# Altium schematic sheet sch_lm3409.SchDoc
size A2
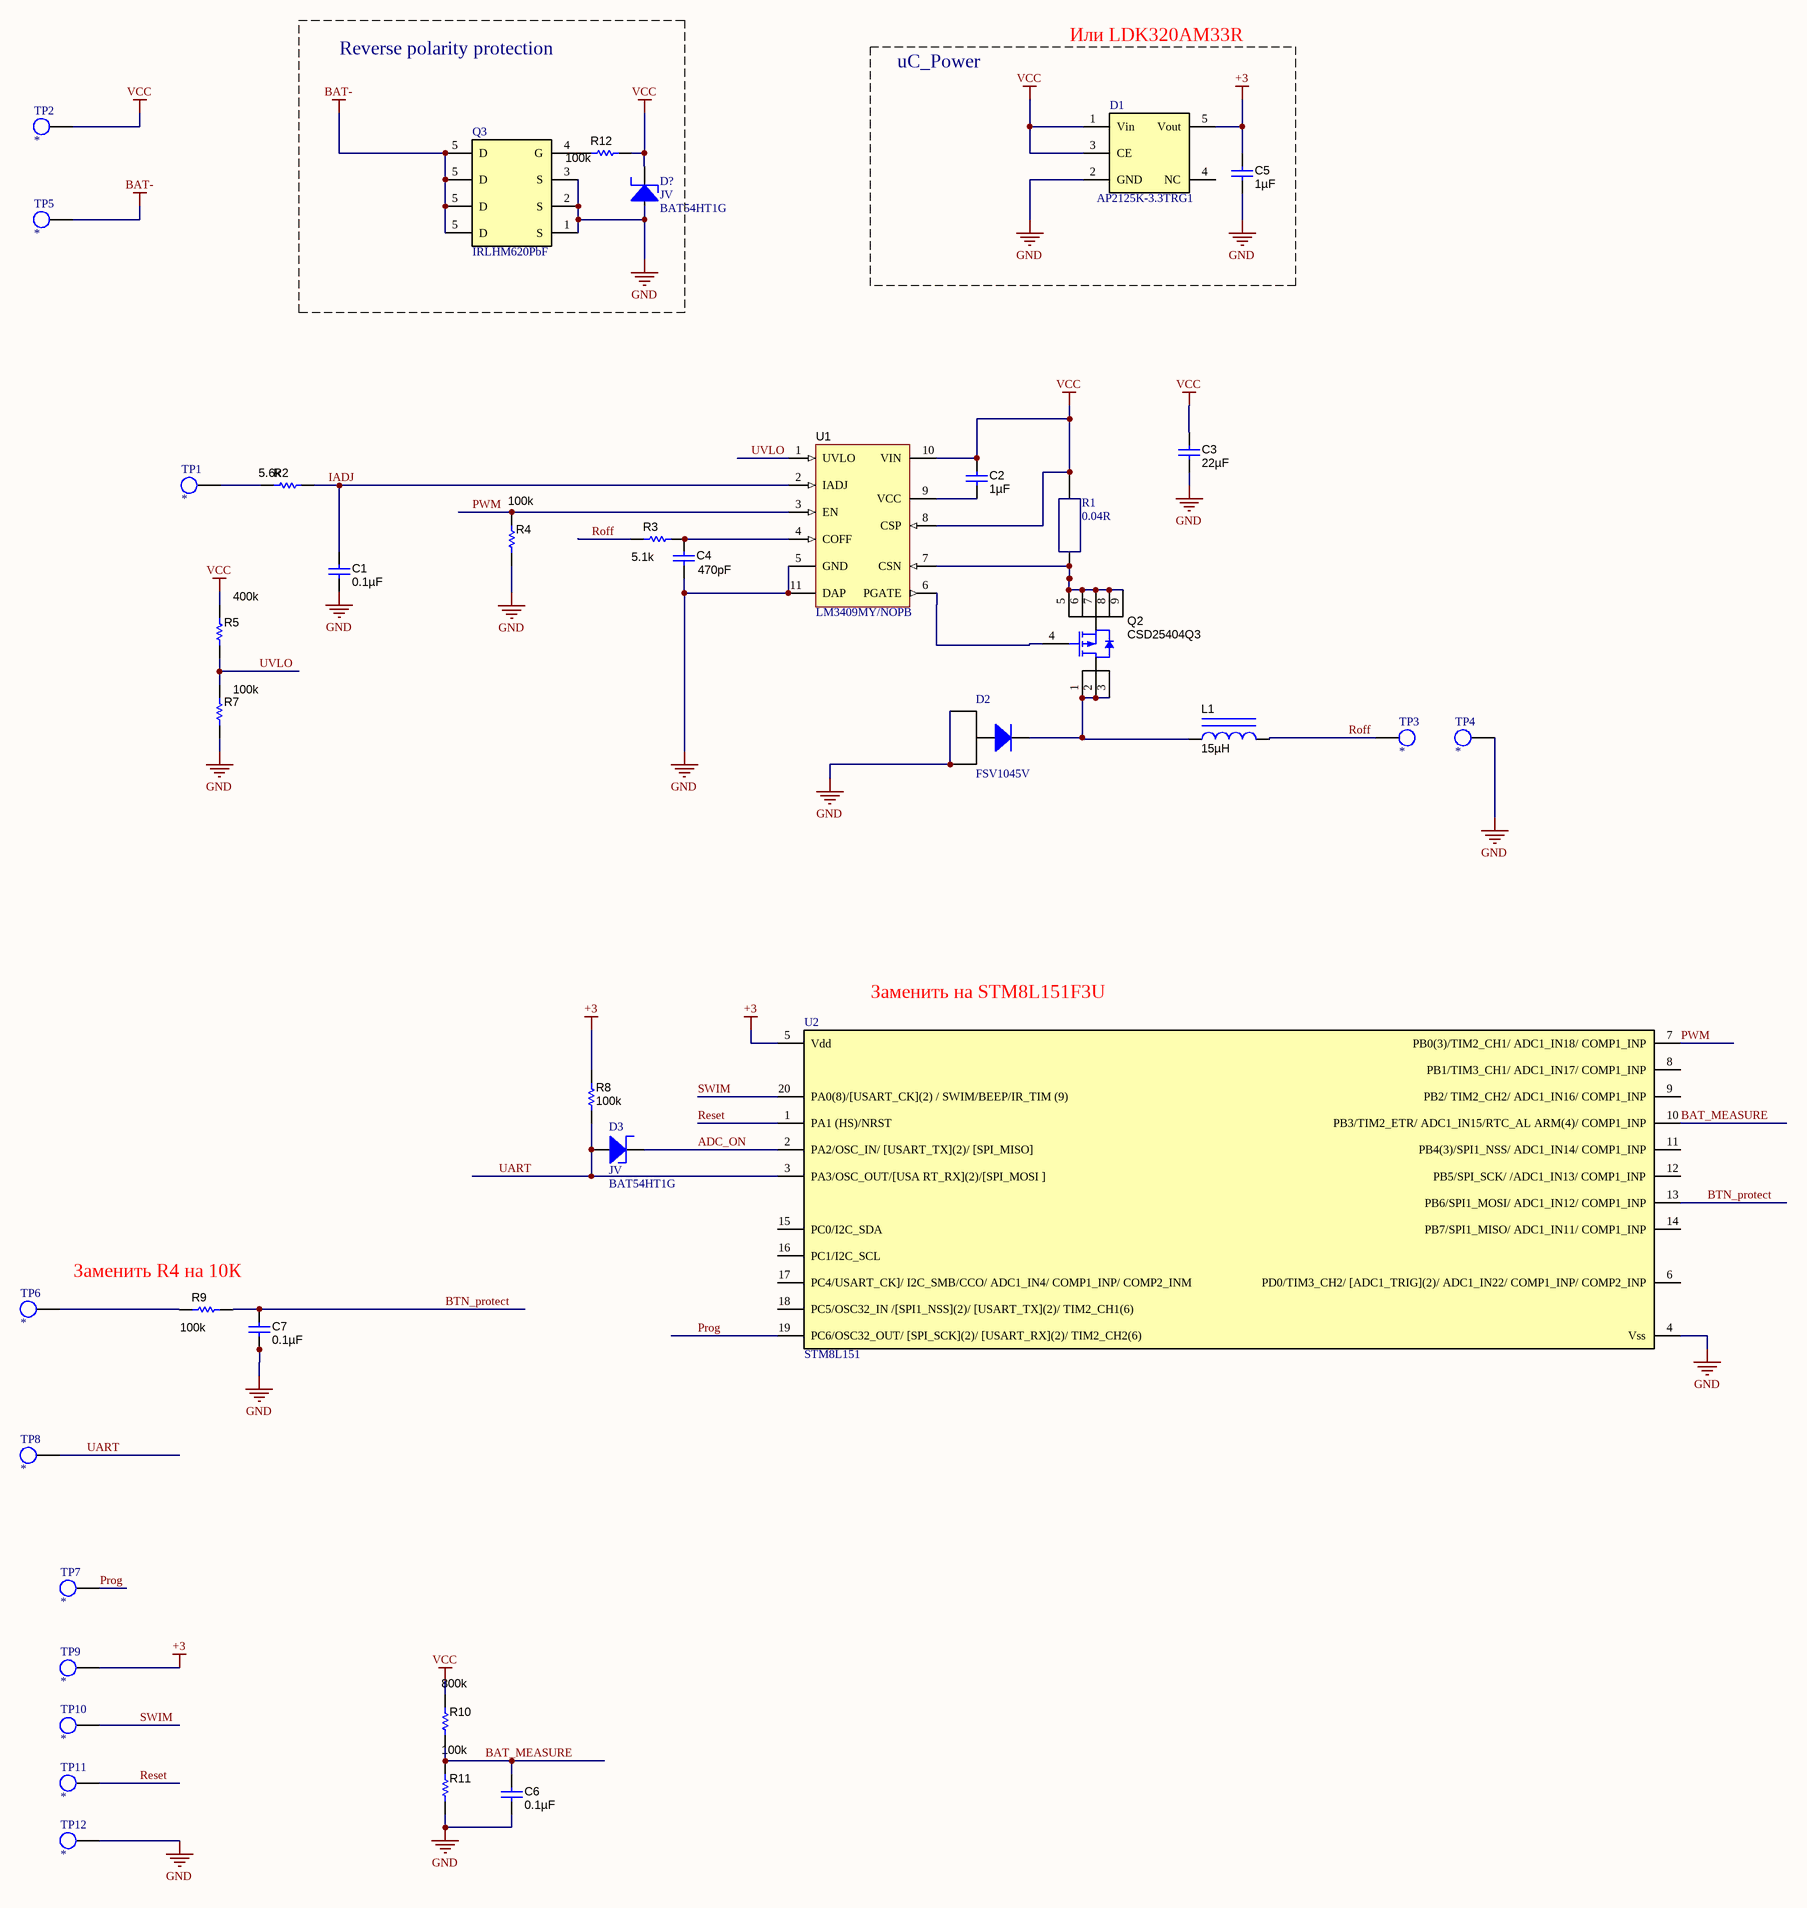
[diagram p0: sch_lm3409.SchDoc]

## Parts
C1  ValueDisplayed: 0.1µF  [0402]  (hidden comment: C1005X7R1E104M050BB)
C2  ValueDisplayed: 1µF  [0603]  (hidden comment: C1608X7R1C105K080AC)
C3  ValueDisplayed: 22µF  [0805_HV]  (hidden comment: C2012X7R1H105K125AB)
C4  value 470pF  [0402]  (hidden comment: C1005X7R1E104M050BB)
C5  ValueDisplayed: 1µF  [0603]  (hidden comment: C1608X7R1C105K080AC)
C6  ValueDisplayed: 0.1µF  [0402]  (hidden comment: C1005X7R1E104M050BB)
C7  ValueDisplayed: 0.1µF  [0402]  (hidden comment: C1005X7R1E104M050BB)
D1  AP2125K-3.3TRG1  [SOT23-5]
D2  FSV1045V  [TO-277]
D3  JV  value BAT54HT1G  [SOD323]
D?  JV  value BAT54HT1G  [SOD323]
L1  ValueDisplayed: 15µH  [WE-TPC-LH]  (hidden comment: 744053150)
Q2  CSD25404Q3  [DQG0008A]
Q3  value IRLHM620PbF  [PQFN-8 3.3x3.3]  (hidden comment: IRLHM620)
R1  value 0.04R  [Resistor 1206]  (hidden comment: PAD)
R2  value 5.6k  [0402]  (hidden comment: CRCW0402470RJNED)
R3  value 5.1k  [0402]  (hidden comment: CRCW0402470RJNED)
R4  value 100k  [0402]  (hidden comment: CRCW0402470RJNED)
R5  value 400k  [0402]  (hidden comment: CRCW0402470RJNED)
R7  value 100k  [0402]  (hidden comment: CRCW0402470RJNED)
R8  ValueDisplayed: 100k  [0402]  (hidden comment: CRCW0402470RJNED)
R9  value 100k  [0402]  (hidden comment: CRCW0402470RJNED)
R10  value 800k  [0402]  (hidden comment: CRCW0402470RJNED)
R11  value 100k  [0402]  (hidden comment: CRCW0402470RJNED)
R12  value 100k  [0402]  (hidden comment: CRCW0402470RJNED)
TP1  *  [TP 0.8mm]  (no BOM)
TP2  *  [TP 0.8mm]  (no BOM)
TP3  *  [TP 0.8mm]  (no BOM)
TP4  *  [TP 0.8mm]  (no BOM)
TP5  *  [TP 0.8mm]  (no BOM)
TP6  *  [TP 0.8mm]  (no BOM)
TP7  *  [TP 0.8mm]  (no BOM)
TP8  *  [TP 0.8mm]  (no BOM)
TP9  *  [TP 0.8mm]  (no BOM)
TP10  *  [TP 0.8mm]  (no BOM)
TP11  *  [TP 0.8mm]  (no BOM)
TP12  *  [TP 0.8mm]  (no BOM)
U1  LM3409MY/NOPB  [MUC10A_N]
U2  STM8L151  [UFQFPN20 3x3x0.5]

## Nets
+3: C5.1 D1.5(Vout) R8.2 TP9.1 U2.5(Vdd)
BAT-: Q3.5(D) TP5.1
GND: C1.2 C3.2 C4.2 C5.2 C6.2 C7.2 D1.2(GND) D2.1 D2.2 D?.2 Q3.1(S) Q3.2(S) Q3.3(S) R4.1 R7.1 R11.1 TP4.1 TP12.1 U1.5(GND) U1.11(DAP) U2.4(Vss)
VCC: C2.1 C3.1 D1.1(Vin) D1.3(CE) D?.1 R1.2 R5.2 R10.2 R12.1 TP2.1 U1.8(CSP) U1.10(VIN)
ADC_ON: D3.1 U2.2(PA2/OSC_IN/_[USART_TX](2)/_[SPI_MISO])
BAT_MEASURE: C6.1 R10.1 R11.2 U2.10(PB3/TIM2_ETR/_ADC1_IN15/RTC_AL_ARM(4)/_COMP1_INP)
BTN_protect: C7.1 R9.1 U2.13(PB6/SPI1_MOSI/_ADC1_IN12/_COMP1_INP)
IADJ: C1.1 R2.2 U1.2(IADJ)
Prog: TP7.1 U2.19(PC6/OSC32_OUT/_[SPI_SCK](2)/_[USART_RX](2)/_TIM2_CH2(6))
PWM: R4.2 U1.3(EN) U2.7(PB0(3)/TIM2_CH1/_ADC1_IN18/_COMP1_INP)
Reset: TP11.1 U2.1(PA1_(HS)/NRST)
Roff: L1.2 R3.1 TP3.1
SWIM: TP10.1 U2.20(PA0(8)/[USART_CK](2)_/_SWIM/BEEP/IR_TIM_(9))
UART: D3.2 R8.1 TP8.1 U2.3(PA3/OSC_OUT/[USA_RT_RX](2)/[SPI_MOSI_])
UVLO: R5.1 R7.2 U1.1(UVLO)
NetC2_2: C2.2 U1.9(VCC)
NetC4_1: C4.1 R3.2 U1.4(COFF)
NetD2_3: D2.3 L1.1 Q2.1(D) Q2.2(D) Q2.3(D)
NetQ2_4: Q2.4(G) U1.6(PGATE)
NetQ2_5: Q2.5(S) Q2.6(S) Q2.7(S) Q2.8(S) Q2.9(S) R1.1 U1.7(CSN)
NetQ3_4: Q3.4(G) R12.2
NetR2_1: R2.1 TP1.1
NetR9_2: R9.2 TP6.1

Not connected (* = marked no-connect by the designer): D1 4(NC); U2 6(PD0/TIM3_CH2/_[ADC1_TRIG](2)/_ADC1_IN22/_COMP1_INP/_COMP2_INP) 8(PB1/TIM3_CH1/_ADC1_IN17/_COMP1_INP) 9(PB2/_TIM2_CH2/_ADC1_IN16/_COMP1_INP) 11(PB4(3)/SPI1_NSS/_ADC1_IN14/_COMP1_INP) 12(PB5/SPI_SCK/_/ADC1_IN13/_COMP1_INP) 14(PB7/SPI1_MISO/_ADC1_IN11/_COMP1_INP) 15(PC0/I2C_SDA) 16(PC1/I2C_SCL) 17(PC4/USART_CK]/_I2C_SMB/CCO/_ADC1_IN4/_COMP1_INP/_COMP2_INM) 18(PC5/OSC32_IN_/[SPI1_NSS](2)/_[USART_TX](2)/_TIM2_CH1(6))

## Notes on the sheet
- Reverse polarity protection
- uC_Power
- Или LDK320AM33R
- (near U2) Заменить на STM8L151F3U
- Заменить R4 на 10К

## Library data of the parts
C1 C6 C7 = C1005X7R1E104M050BB: CAP, CERM, 0.1 µF, 25 V, +/- 20%, X7R, 0402; Manufacturer: TDK; Polarized: N; CompType: Capacitor; Value: 0.1uF; U/M: EA; Cap_F: 0.0000001; Tolerance_%: 20; Value1: Unknown; VDC_V: 25; Value2: 25V; TaMin_C: -55; TaMax_C: 125; SizeArea_mm2: 0.5; SizeAreaWB_mm2: 3; SizeX_mm: 1; SizeZ_mm: 0.6; AEC Category: Q200; SymbolVersion: 2008-07-09; PartNumber: C1005X7R1E104M050BB; PackageReference: 0402; RoHS: Y; MountType: SMT; Technology: Ceramic; TempCo: X7R; Cap_Case: 0402; SizeY_mm: 0.5; Published: 2008-06-19; Publisher: Texas Instruments; LatestRevisionDate: 2017-02-09; ComponentLink1Description: Datasheet link; ComponentLink1URL: http://product.tdk.com/en/catalog/datasheets/mlcc_commercial_general_en.pdf; Supplier 1: Digi-Key; Supplier Part Number 1: 445-7349-1-ND; Supplier 2: Mouser; Supplier Part Number 2: 810-C1005X7R1E104M; Supplier 3: Farnell; Supplier Part Number 3: 2354087; AEC Qualified: N; AEC Grade: N/A
C2 C5 = C1608X7R1C105K080AC: CAP, CERM, 1 µF, 16 V, +/- 10%, X7R, 0603; Manufacturer: TDK; Polarized: N; CompType: Capacitor; Value: 1uF; U/M: EA; Cap_F: 0.000001; Tolerance_%: 10; ESR_ohm: 0.0057; Value1: 0.0057 ohm; VDC_V: 16; Value2: 16V; TaMin_C: -55; TaMax_C: 125; SizeArea_mm2: 1.28; SizeAreaWB_mm2: 4.68; SizeX_mm: 1.6; SizeY_mm: 0.8; SizeZ_mm: 1; AEC Category: Q200; SymbolVersion: 2008-07-09; PartNumber: C1608X7R1C105K080AC; PackageReference: 0603; RoHS: Y; MountType: SMT; Technology: Ceramic; TempCo: X7R; Cap_Case: 0603; Published: 2008-06-19; Publisher: Texas Instruments; LatestRevisionDate: 2016-10-05; ComponentLink1Description: Datasheet link; ComponentLink1URL: http://www.tdk.co.jp/tefe02/e412_c.pdf; Supplier 1: Digi-Key; Supplier Part Number 1: 445-1604-1-ND; Supplier 2: Mouser; Supplier Part Number 2: 810-C1608X7R1C105K; Supplier 3: Farnell; Supplier Part Number 3: 1907343; AEC Qualified: ?
C3 = C2012X7R1H105K125AB: CAP, CERM, 1 µF, 50 V, +/- 10%, X7R, 0805; Manufacturer: TDK; Polarized: N; CompType: Capacitor; Value: 1uF; U/M: EA; Cap_F: 0.000001; Tolerance_%: 10; ESR_ohm: 0.008782; Value1: 0.008782 ohm; VDC_V: 50; Value2: 50V; IRMS_A: 2.20488; TaMin_C: -55; TaMax_C: 125; Cap_Case: 0805; SizeArea_mm2: 2.5; SizeAreaWB_mm2: 6.75; SizeX_mm: 2; SizeY_mm: 1.25; SizeZ_mm: 1.45; AEC Category: Q200; SymbolVersion: 2008-07-09; PartNumber: C2012X7R1H105K125AB; PackageReference: 0805; RoHS: Y; MountType: SMT; Technology: Ceramic; TempCo: X7R; Published: 2008-06-19; Publisher: Texas Instruments; LatestRevisionDate: 2017-01-30; ComponentLink1Description: Datasheet link; ComponentLink1URL: https://product.tdk.com/en/search/capacitor/ceramic/mlcc/info?part_no=C2012X7R1H105K125AB; Supplier 1: Digi-Key; Supplier Part Number 1: 445-7547-1-ND; Supplier 2: Mouser; Supplier Part Number 2: 810-C2012X7R1H105K; AEC Qualified: N; AEC Grade: N/A
C4 = C1005X7R1E104M050BB: CAP, CERM, 0.1 µF, 25 V, +/- 20%, X7R, 0402; Manufacturer: TDK; Polarized: N; CompType: Capacitor; U/M: EA; Cap_F: 0.0000001; Tolerance_%: 20; Value1: Unknown; VDC_V: 25; Value2: 25V; TaMin_C: -55; TaMax_C: 125; SizeArea_mm2: 0.5; SizeAreaWB_mm2: 3; SizeX_mm: 1; SizeZ_mm: 0.6; AEC Category: Q200; SymbolVersion: 2008-07-09; PartNumber: C1005X7R1E104M050BB; PackageReference: 0402; RoHS: Y; MountType: SMT; Technology: Ceramic; TempCo: X7R; Cap_Case: 0402; SizeY_mm: 0.5; Published: 2008-06-19; Publisher: Texas Instruments; LatestRevisionDate: 2017-02-09; ComponentLink1Description: Datasheet link; ComponentLink1URL: http://product.tdk.com/en/catalog/datasheets/mlcc_commercial_general_en.pdf; Supplier 1: Digi-Key; Supplier Part Number 1: 445-7349-1-ND; Supplier 2: Mouser; Supplier Part Number 2: 810-C1005X7R1E104M; Supplier 3: Farnell; Supplier Part Number 3: 2354087; AEC Qualified: N; AEC Grade: N/A; ValueDisplayed: 470pF
D1 = AP2125K-2.8TRG1: Component Name: IC,  LDO REGULATOR, AP2125K-3.3TRG1, SOT23-5; Package: SOT23-5; Marking: AP2125K-3.3TRG1; ComponentLink1Description: Datasheet; ComponentLink1URL: https://www.diodes.com/assets/Datasheets/AP2125.pdf; Mounting type: SMD; Value: AP2125K-3.3TRG1
D2 = CMP-03102-1: Component Name: Ultra Low VF schottky rectifier diodes, FSV1045V, TO-277; ComponentLink1URL: https://www.fairchildsemi.com/datasheets/FS/FSV1045V.pdf; Value: FSV1045V; ComponentLink1Description: Datasheet; Mounting type: SMD; Marking: FSV1045V; Package: TO-277
D3 D? = CMP-00083-4: BAT54HT1G; Component Name: Schottky Barrier Diodes, BAT54HT1G, SOD-323; Package: SOD-323; Marking: JV; ComponentLink1Description: Datasheet; ComponentLink1URL: http://www.onsemi.ru.com/pub_link/Collateral/BAT54HT1-D.PDF; Mounting type: SMD
L1 = 744053150: Inductor, Shielded Drum Core, Ferrite, 15 µH, 1.15 A, 0.07 ohm, SMD; Manufacturer: Wurth Elektronik; Value: 15uH; Ind_H: 15.0E-6; Imax_A: 1.15; Irms: 1.38A @ 30C rise; Isat: 1.15A @ 35% inductance drop; DCR_ohm: 0.07; Value2: 1.15A; SizeAreaWB_mm2: 60.84; SizeArea_mm2: 33.64; SizeX_mm: 5.8; SizeZ_mm: 2.8; AEC Category: Q200; SymbolVersion: 2008-07-23; CompType: Inductor; PartNumber: 744053150; Value1: 0.07 ohm; Technology: Shielded Drum Core; MountType: SMT; Material: Ferrite; PackageReference: WE-TPC-LH; Published: 2008-06-26; Publisher: Texas Instruments; LatestRevisionDate: 2017-02-06; ComponentLink1Description: Datasheet link; ComponentLink1URL: http://www.we-online.com/eisos/pdf/744053150.pdf; RoHS: Y; SizeY_mm: 5.8; Supplier 1: Digi-Key; Supplier Part Number 1: 732-1045-1-ND; Supplier 2: Mouser; Supplier Part Number 2: 710-744053150; AEC Qualified: ?
Q2 = CSD25404Q3: MOSFET, P-CH, -20 V, -60 A, DQG0008A (VSON-CLIP-8); Manufacturer: Texas Instruments; Alternate Manufacturer: None; SymbolCreator: a0799628; U/M: EA; ChType: P; Value: -20V; Value1: 0.0065 ohm; Rdson45_ohm: 0.0065; Value2: 10.8 nC; QgTyp_nC: 10.8; Vgs_V: -12; SizeAreaWB_mm2: 18.49; SizeArea_mm2: 10.89; SizeX_mm: 3.3; SizeZ_mm: 1.1; AEC Category: Q101; AEC Qualified: N; SymbolVersion: 2014-08-22; PartNumber: CSD25404Q3; PackageReference: DQG0008A; CompType: MOSFET; VdsMax_V: -20; IdsMax_A: -60; SizeY_mm: 3.3; RoHS: Y; MountType: SMT; Published: 2008-06-19; Publisher: Texas Instruments; LatestRevisionDate: 2017-06-02; LatestRevisionNote: Added parts.; ComponentLink1Description: Datasheet link; ComponentLink1URL: http://www.ti.com/lit/ds/symlink/csd25404q3.pdf
Q3 = IRLHM620PbF: Component Name: HEXFET Power MOSFET, IRLHM620PbF , PQFN-8 3x3MM; ComponentLink1URL: https://www.infineon.com/dgdl/irlhm620pbf.pdf?fileId=5546d462533600a4015356638be325a3; ComponentLink1Description: Datasheet; Mounting type: SMD; Marking: IRLHM620; Package: PQFN-8 3x3
R1 = Resistors_1: Component Name: PAD; Marking: PAD; Package: 1206
R2-R5 R7 R9-R12 = CRCW0402470RJNED: RES, 470, 5%, 0.063 W, 0402; Manufacturer: Vishay-Dale; CompType: Resistor; Res_ohm: 470; Value_Code: 470R; Tolerance_%: 5; Power_W: 0.063; Value2: 0.063W; VDC_V: 50; TempCo: 200 ppm/C; SizeArea_mm2: 0.5; SizeX_mm: 1; SizeZ_mm: 0.6; EIA_Code: E24; U/M: EA; AEC Category: Q200; SymbolVersion: 2009-05-29; PartNumber: CRCW0402470RJNED; PackageReference: 0402; RoHS: Y; Value1: 5%; MountType: SMT; Technology: Thick Film; SizeY_mm: 0.5; Published: 2008-06-26; Publisher: Texas Instruments; LatestRevisionDate: 2017-01-28; ComponentLink1Description: Datasheet link; ComponentLink1URL: http://www.vishay.com/docs/20035/dcrcwe3.pdf; Supplier 1: Digi-Key; Supplier Part Number 1: 541-470JCT-ND; Supplier 2: Newark; Supplier Part Number 2: 59M6737; Supplier 3: Mouser; Supplier Part Number 3: 71-CRCW0402J-470-E3; AEC Qualified: ?
  R2: ValueDisplayed: 5.6k
  R3: ValueDisplayed: 5.1k
  R4 R7 R9 R11 R12: ValueDisplayed: 100k
  R5: ValueDisplayed: 400k
  R10: ValueDisplayed: 800k
R8 = CRCW0402470RJNED: RES, 470, 5%, 0.063 W, 0402; Manufacturer: Vishay-Dale; CompType: Resistor; Value: 470; Value_Code: 470R; Tolerance_%: 5; Power_W: 0.063; Value2: 0.063W; VDC_V: 50; TempCo: 200 ppm/C; SizeArea_mm2: 0.5; SizeX_mm: 1; SizeZ_mm: 0.6; EIA_Code: E24; U/M: EA; AEC Category: Q200; SymbolVersion: 2009-05-29; PartNumber: CRCW0402470RJNED; PackageReference: 0402; RoHS: Y; Res_ohm: 470; Value1: 5%; MountType: SMT; Technology: Thick Film; SizeY_mm: 0.5; Published: 2008-06-26; Publisher: Texas Instruments; LatestRevisionDate: 2017-01-28; ComponentLink1Description: Datasheet link; ComponentLink1URL: http://www.vishay.com/docs/20035/dcrcwe3.pdf; Supplier 1: Digi-Key; Supplier Part Number 1: 541-470JCT-ND; Supplier 2: Newark; Supplier Part Number 2: 59M6737; Supplier 3: Mouser; Supplier Part Number 3: 71-CRCW0402J-470-E3; AEC Qualified: ?
TP1-TP12 = CMP-00326-5: TP 0.8mm; Component Name: Connector, TP 0.8mm; Package: 0.8mm; Marking: *; ComponentLink1Description: Datasheet; ComponentLink1URL: *
U1 = LM3409MY/NOPB: PFET Buck Controller for High Power LED Drives, 10-pin eMSOP, Pb-Free; Manufacturer: Texas Instruments; PackageTopMarking: ZXTT*SXFB; PowerWise: Y; CompType: MiscPower; Published: 1-Mar-2010; LatestRevisionDate: 01-Oct-2010; LatestRevisionNote: Updated datasheet to version Apr-2010.; DatasheetVersion: Apr-2010; PackageVersion: revA, May-2006; PackageReference: MUC10A; Publisher: Altium Limited; PackageDescription: Molded Mini-SO, Exposed Pad .118 x .118 x .034in Body, 10 Lead, .0197in Pitch; Supplier 1: Digi-Key; Supplier Part Number 1: LM3409MYTR-ND; Supplier 2: Digi-Key; Supplier Part Number 2: LM3409MYCT-ND; Supplier 3: Digi-Key; Supplier Part Number 3: LM3409MYDKR-ND; Supplier 4: Farnell; Supplier Part Number 4: 1735797; PartNumber: LM3409MY/NOPB; RoHS: Y; PinCount: 10; Code_JEDEC: MO-187-BAT; ComponentLink1Description: LM3409 Datasheet; ComponentLink1URL: http://www.national.com/ds/LM/LM3409.pdf; ComponentLink2Description: LM3409 Web Page; ComponentLink2URL: http://www.national.com/pf/LM/LM3409.html; ComponentLink3Description: MUC10A Package Page; ComponentLink3URL: http://www.national.com/packaging/folders/muc10a.html
U2 = CMP-03101-1: STM8L151F3U; Component Name: IC, Microcontroller, STM8L151F3U, UFQFPN20; ComponentLink1URL: http://static6.arrow.com/aropdfconversion/39f28eae92662fce6231fc67e6fb213a085d3966/1988500997581432dm00027749.pdf; Value: STM8L151F3U; ComponentLink1Description: Datasheet; Mounting type: SMD; Marking: STM8L151; Package: UFQFPN20